# EasyEDA Pro project ActiveMoCapDeck_pre.eprj

# Schematic ActivaMoCapDeck
Board Name: ActiveMoCapDeck; Create Date: 2024-09-30; Page Name: sch_1; Project Name: ActiveMoCapDeck; Schematic Name: ActivaMoCapDeck; Update Date: 2024-10-01
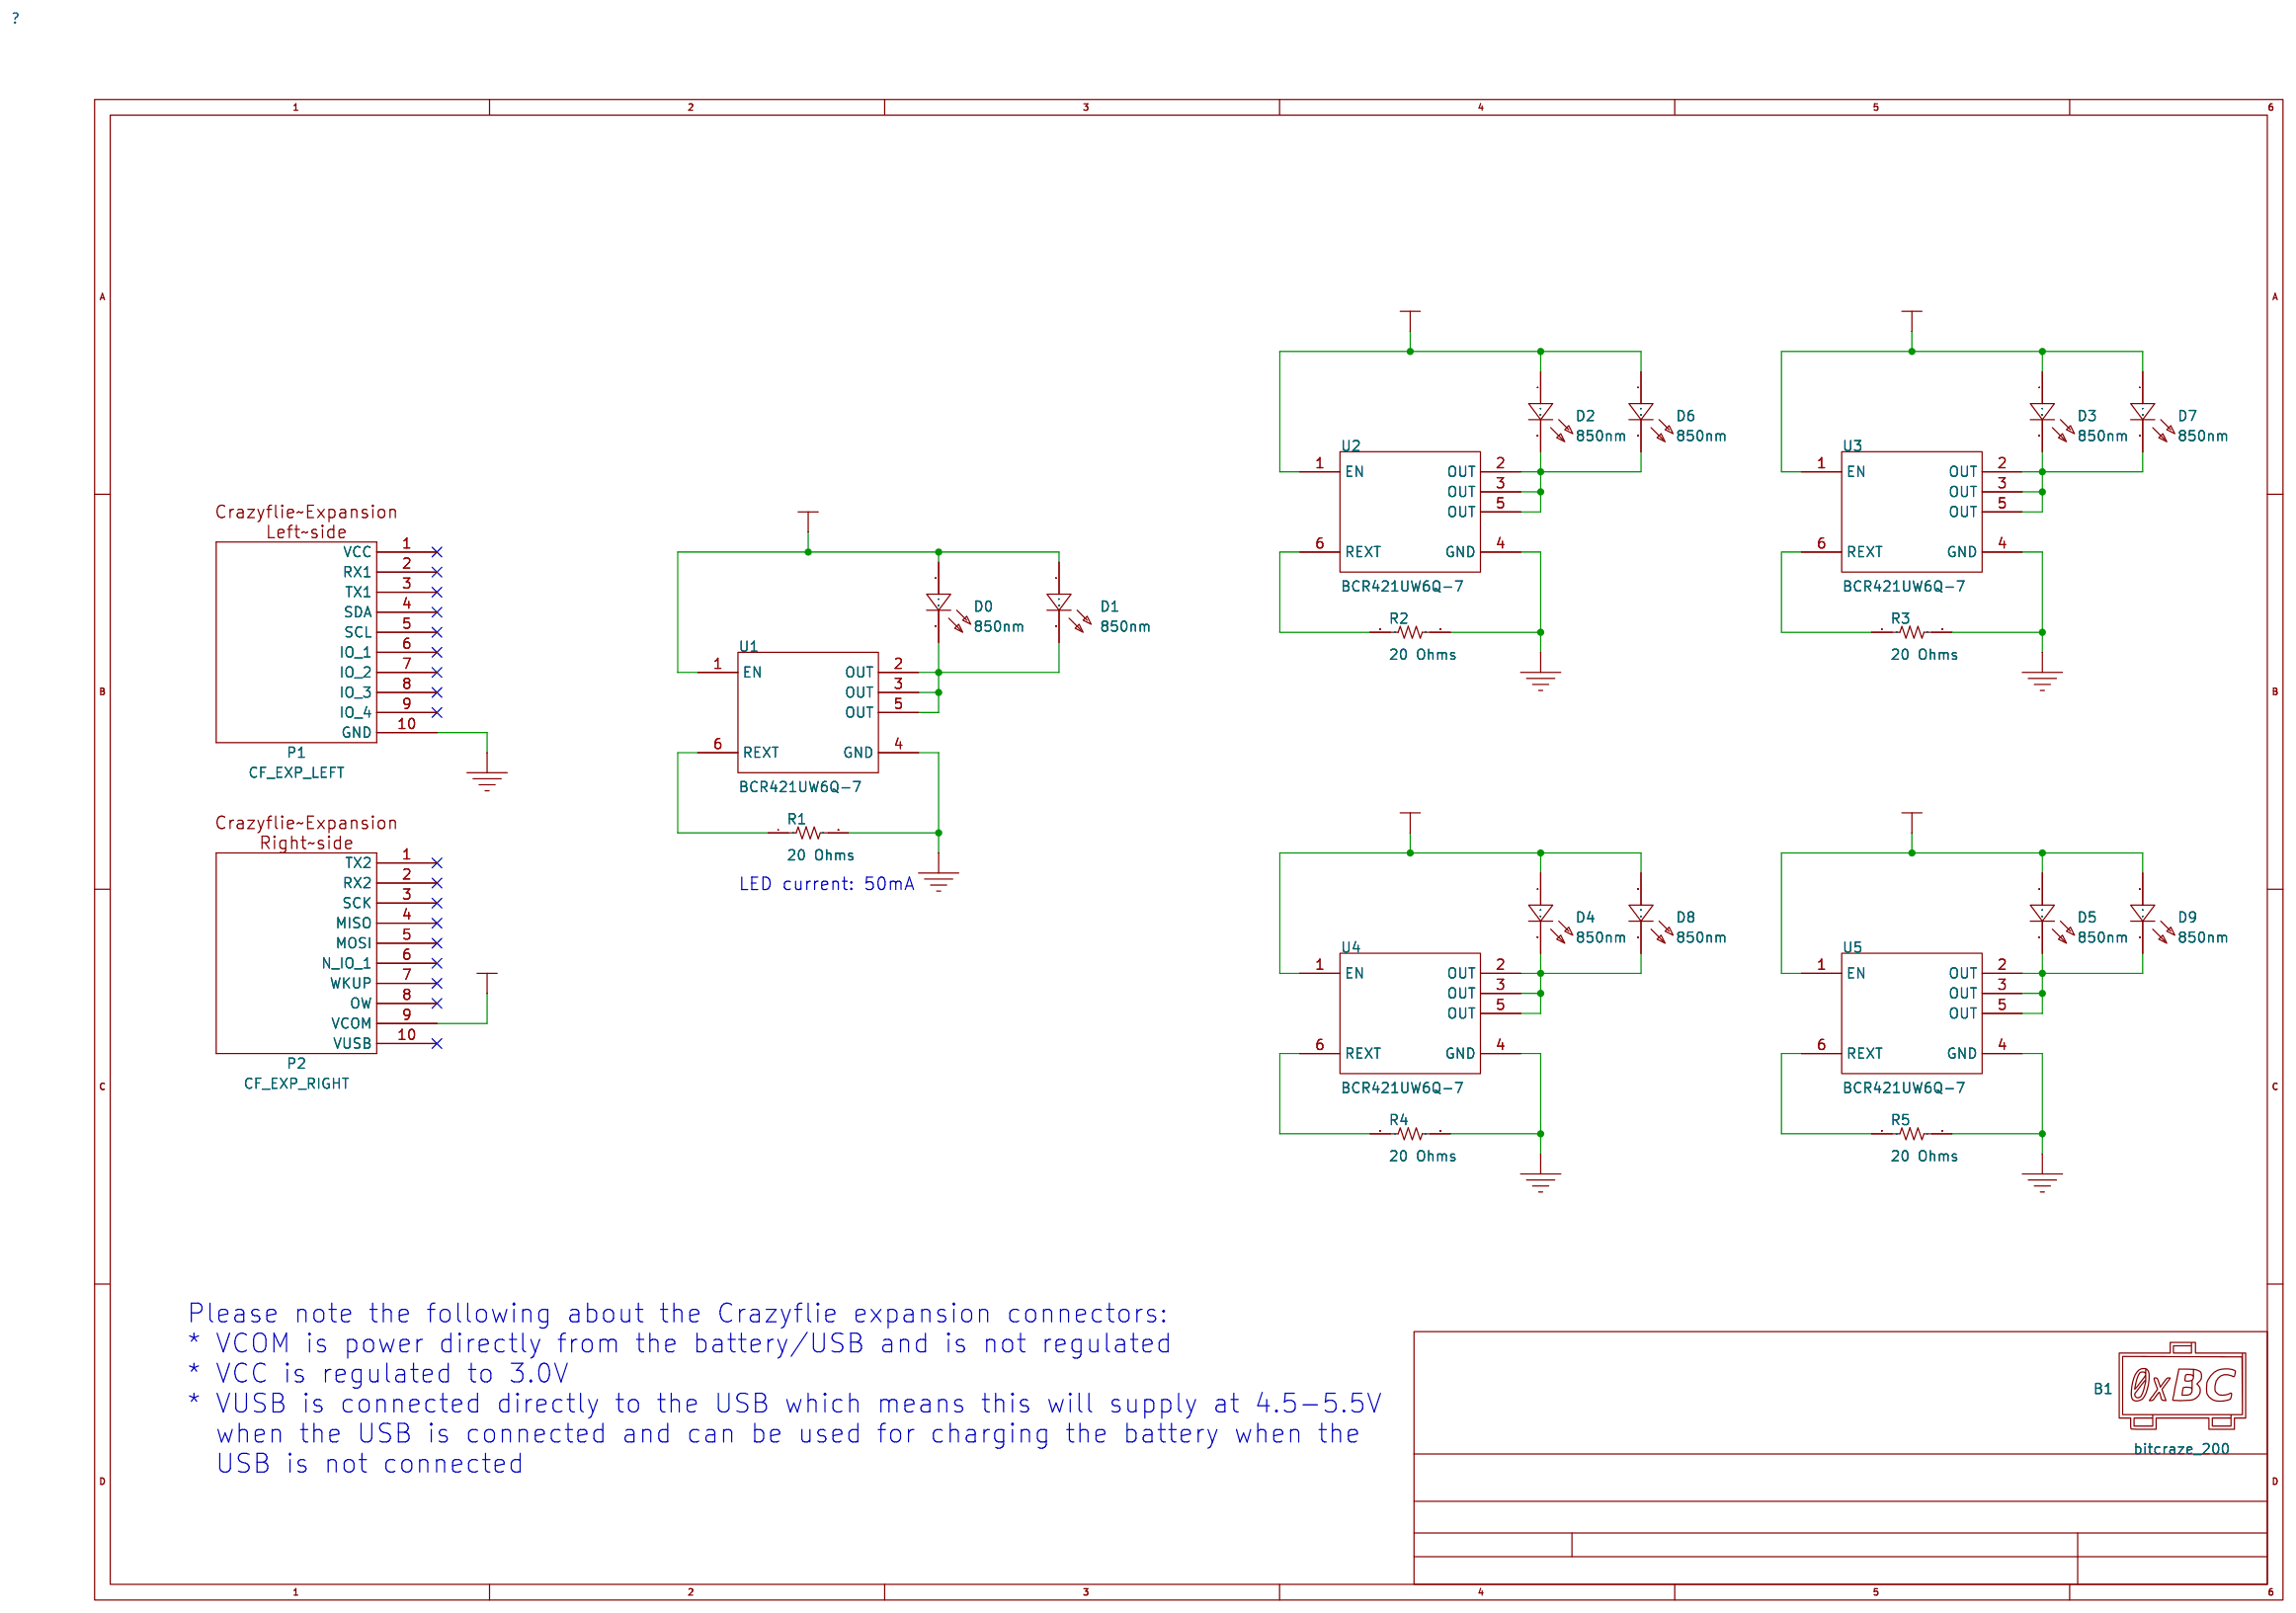
[diagram p0: schematic sheet]

## Parts
B1  bitcraze_200  [EXP_ORIENTATION]
D0  Red  [LED 0603_1608 RED]
D1  Red  [LED 0603_1608 RED]
D2  Red  [LED 0603_1608 RED]
D3  Red  [LED 0603_1608 RED]
D4  Red  [LED 0603_1608 RED]
D5  Red  [LED 0603_1608 RED]
D6  Red  [LED 0603_1608 RED]
D7  Red  [LED 0603_1608 RED]
D8  Red  [LED 0603_1608 RED]
D9  Red  [LED 0603_1608 RED]
P1  CF_EXP_LEFT  [BF090-10-X-B2]
P2  CF_EXP_RIGHT  [BF090-10-X-B2]
R1  20 Ohms  [RES 0603_1608]
R2  20 Ohms  [RES 0603_1608]
R3  20 Ohms  [RES 0603_1608]
R4  20 Ohms  [RES 0603_1608]
R5  20 Ohms  [RES 0603_1608]
U1  BCR421UW6Q-7  [FP-SOT26_SC74R-MFG]
U2  BCR421UW6Q-7  [FP-SOT26_SC74R-MFG]
U3  BCR421UW6Q-7  [FP-SOT26_SC74R-MFG]
U4  BCR421UW6Q-7  [FP-SOT26_SC74R-MFG]
U5  BCR421UW6Q-7  [FP-SOT26_SC74R-MFG]

## Library data of the parts
B1 = bitcraze_200
D0-D9 = 850nm: LED RED SMD; Part Number: CL-196HR-CD-T; ComponentLink1Description: Datasheet; ComponentLink1URL: http://ce.citizen.co.jp/up_img/product/zzOM8tpTLfGL/CL-196_e.pdf; ComponentLink2Description: DigiKey Link; ComponentLink2URL: https://www.digikey.com/en/products/detail/citizen/CL-196HR-CD-T/6005906; Configuration: Standard; Current - Test: 20mA; Device Package: 0603 (1608 Metric); Height (Max): 0.60mm; LastUpdated: 30/08/2022 14:34:25; Lens Color: 0.60mm; Lens Size: 1.60mm x 0.80mm; Lens Style: Rectangle with Flat Top; Lifecycle Status: Active; Manufacturer: Citizen; Millicandela Rating: 23mcd; Minimum Order: 1; Mounting Type: Surface Mount; Package / Case: 0603 (1608 Metric); Packaging: TapeAndReel; PartId: 499; Part Status: Active; Price: 0.06; Series: CL-196; Size / Dimension: 1.60mm L x 0.80mm W; Voltage - Forward (Vf) (Typ): 1.8V; Wavelength - Dominant: 640nm; Supplier 1: Arrow Electronics; Supplier Part Number 1: HIR19-21C/L11/TR8; Design Item ID: CL-196HR-CD-T; Library Name: Celestial Altium Library - altium_library; Datasheet: http://ce.citizen.co.jp/up_img/product/zzOM8tpTLfGL/CL-196_e.pdf
P1 = CF_EXP_LEFT: Library Name: *
P2 = CF_EXP_RIGHT: Library Name: *
R1-R5 = 20 Ohms: RES 20 OHM 5% 1/10W 0603; Part Number: RC0603JR-0720RL; ComponentLink1Description: Datasheet; ComponentLink1URL: https://www.yageo.com/upload/media/product/productsearch/datasheet/rchip/PYu-RC_Group_51_RoHS_L_10.pdf; ComponentLink2Description: DigiKey Link; ComponentLink2URL: https://www.digikey.com/en/products/detail/yageo/RC0603JR-0720RL/726739; Composition: Thick Film; Device Package: 0603 (1608 Metric); Features: Moisture Resistant; Height - Seated (Max): 0.022&quot; (0.55mm); LastUpdated: 01/09/2022 12:52:35; Lifecycle Status: Active; Manufacturer: Yageo; Minimum Order: 1; Number of Terminations: 2; Operating Temperature: -55°C ~ 155°C; Package / Case: 0603 (1608 Metric); Packaging: CutTape; PartId: 17211; Part Status: Active; Power (Watts): 0.1W, 1/10W; Price: 0.01; Series: RC_L; Size / Dimension: 0.063&quot; L x 0.031&quot; W (1.60mm x 0.80mm); Supplier 1: DigiKey; Supplier Part Number 1: 311-20GRCT-ND; Supplier Device Package: 0603; Temperature Coefficient: ±100ppm/°C; Tolerance: ±5%; Design Item ID: RC0603JR-0720RL; Library Name: Celestial Altium Library - altium_library; Datasheet: https://www.yageo.com/upload/media/product/productsearch/datasheet/rchip/PYu-RC_Group_51_RoHS_L_10.pdf
U1-U5 = BCR421UW6Q-7: TRANSISTOR LED DRIVER SOT26 T&amp;R; Manufacturer: Diodes Inc.; Digikey Description: TRANSISTOR LED DRIVER SOT26 T&amp;R; Octopart: https://octopart.com/bcr421uw6q-7-diodes+inc.-67219224; Lead Free: Yes; Output Current: 10mA; Footprint Url: https://www.diodes.com/assets/Package-Files/SOT26-SC74R.pdf; ComponentLink2URL: https://www.diodes.com/assets/Datasheets/BCR420UW6Q_BCR421UW6Q.pdf; ComponentLink2Description: Datasheet; Automotive: Yes; Temperature Range High: +150°C; Device Class L3: LED Drivers; RoHS: TRUE; Number Of Outputs: 1; Temperature Range Low: -55°C; Max Junction Temp: +150°C; Automotive Grade: Grade 0; Device Class L2: Power Management ICs; Category: IC; Standoff Height: 0.013mm; Device Class L1: Integrated Circuits (ICs); Mouser Description: LED Lighting Drivers 40V Linear LED 1W 10mA 10% 350mA; Dimming: PWM; Height: 1.4mm; Temperature: -55°C to +150°C; Max Power Dissipation: 912mW; Output Voltage: 40V; Origin Footprint 2: FP-SOT26_SC74R-IPC_C; Origin Footprint 3: FP-SOT26_SC74R-IPC_B; Origin Footprint 4: FP-SOT26_SC74R-IPC_A; Design Item ID: CMP-12753-000005-1; Library Name: Altium Content Vault; Datasheet: https://www.diodes.com/assets/Datasheets/BCR420UW6Q_BCR421UW6Q.pdf

## Nets
GND: P1.10(GND) R1.2 R2.2 R3.2 R4.2 R5.2 U1.4(GND) U2.4(GND) U3.4(GND) U4.4(GND) U5.4(GND)
VCOM: D0.1 D1.1 D2.1 D3.1 D4.1 D5.1 D6.1 D7.1 D8.1 D9.1 P2.9(VCOM) U1.1(EN) U2.1(EN) U3.1(EN) U4.1(EN) U5.1(EN)
$1N1437: R1.1 U1.6(REXT)
$1N1453: R4.1 U4.6(REXT)
$1N1460: D0.2 D1.2 U1.2(OUT) U1.3(OUT) U1.5(OUT)
$1N1467: R2.1 U2.6(REXT)
$1N1488: R5.1 U5.6(REXT)
$1N1492: D5.2 D9.2 U5.2(OUT) U5.3(OUT) U5.5(OUT)
$1N1510: D4.2 D8.2 U4.2(OUT) U4.3(OUT) U4.5(OUT)
$1N1524: R3.1 U3.6(REXT)
$1N1533: D3.2 D7.2 U3.2(OUT) U3.3(OUT) U3.5(OUT)
$1N1560: D2.2 D6.2 U2.2(OUT) U2.3(OUT) U2.5(OUT)

Not connected (* = marked no-connect by the designer): P1 1(VCC)* 2(RX1)* 3(TX1)* 4(SDA)* 5(SCL)* 6(IO_1)* 7(IO_2)* 8(IO_3)* 9(IO_4)*; P2 1(TX2)* 2(RX2)* 3(SCK)* 4(MISO)* 5(MOSI)* 6(N_IO_1)* 7(WKUP)* 8(OW)* 10(VUSB)*

## Notes on the sheet
- LED current: 50mA
- Please note the following about the Crazyflie expansion connectors:
  * VCOM is power directly from the battery/USB and is not regulated
  * VCC is regulated to 3.0V
  * VUSB is connected directly to the USB which means this will supply at 4.5-5.5V
    when the USB is connected and can be used for charging the battery when the
    USB is not connected

# Board pcb
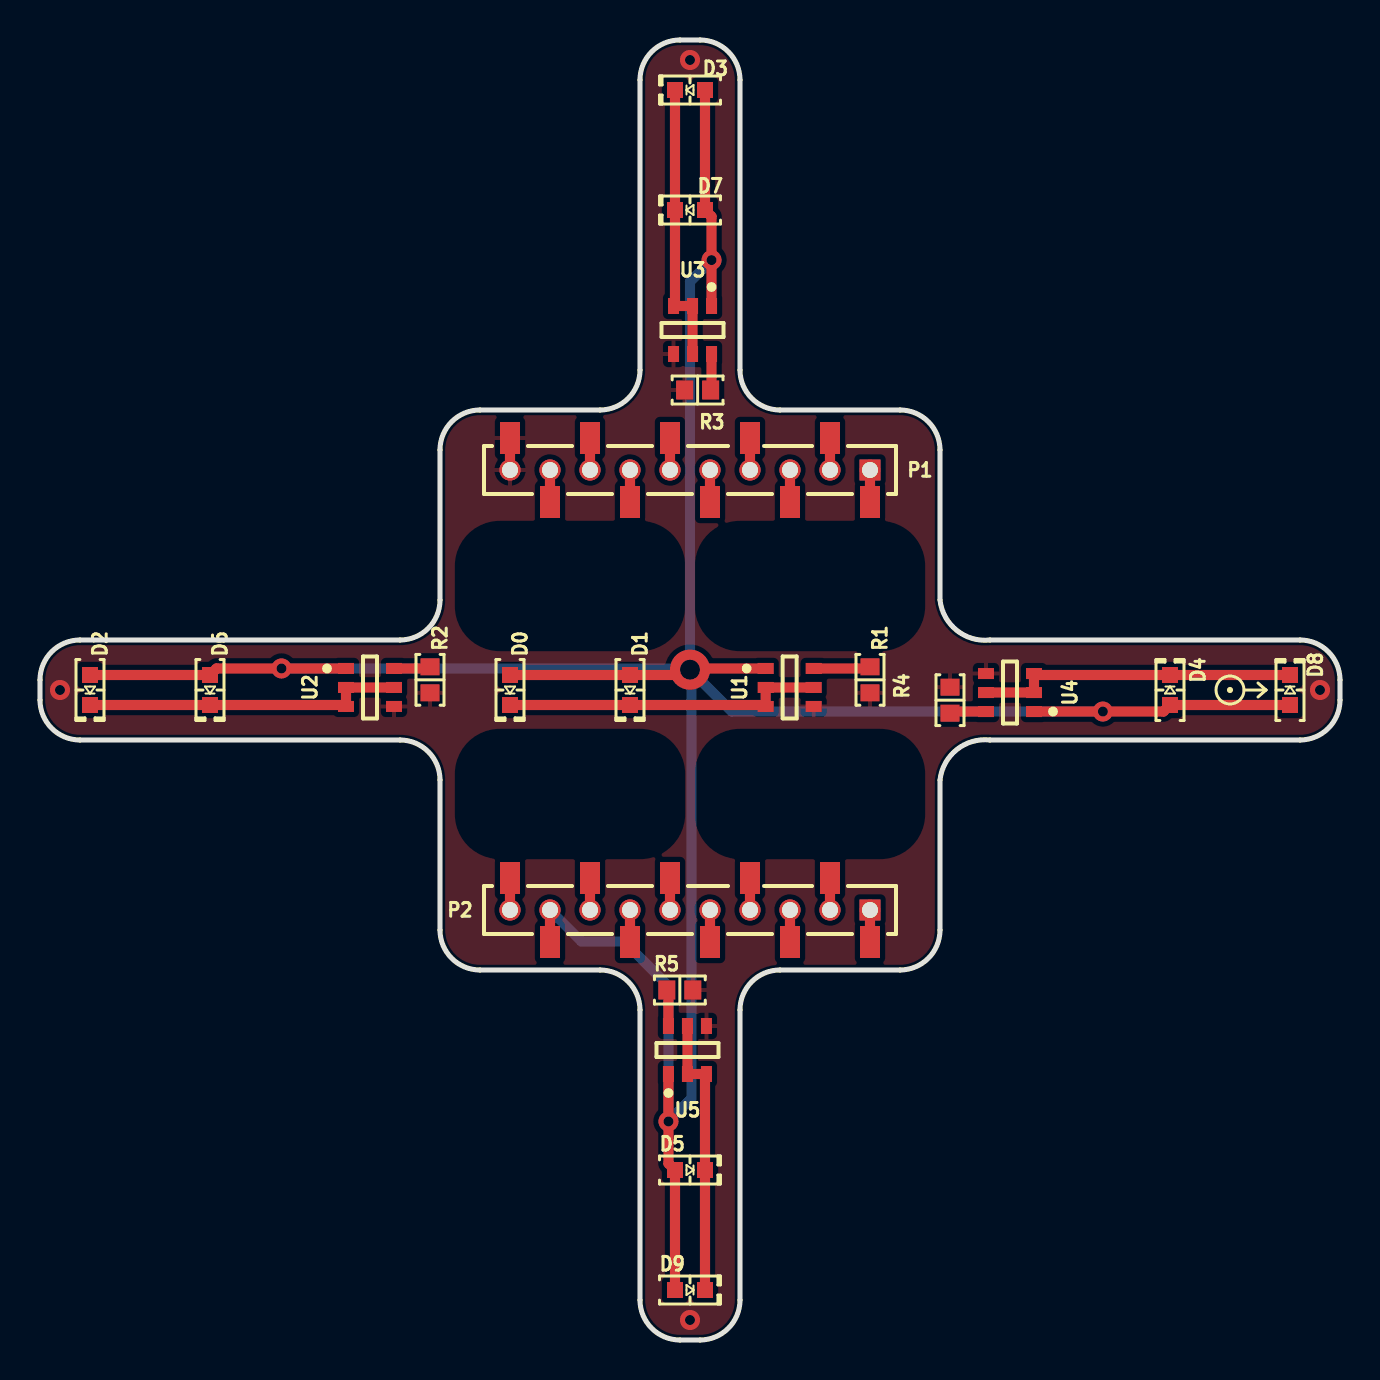
[diagram p1: board, top side]
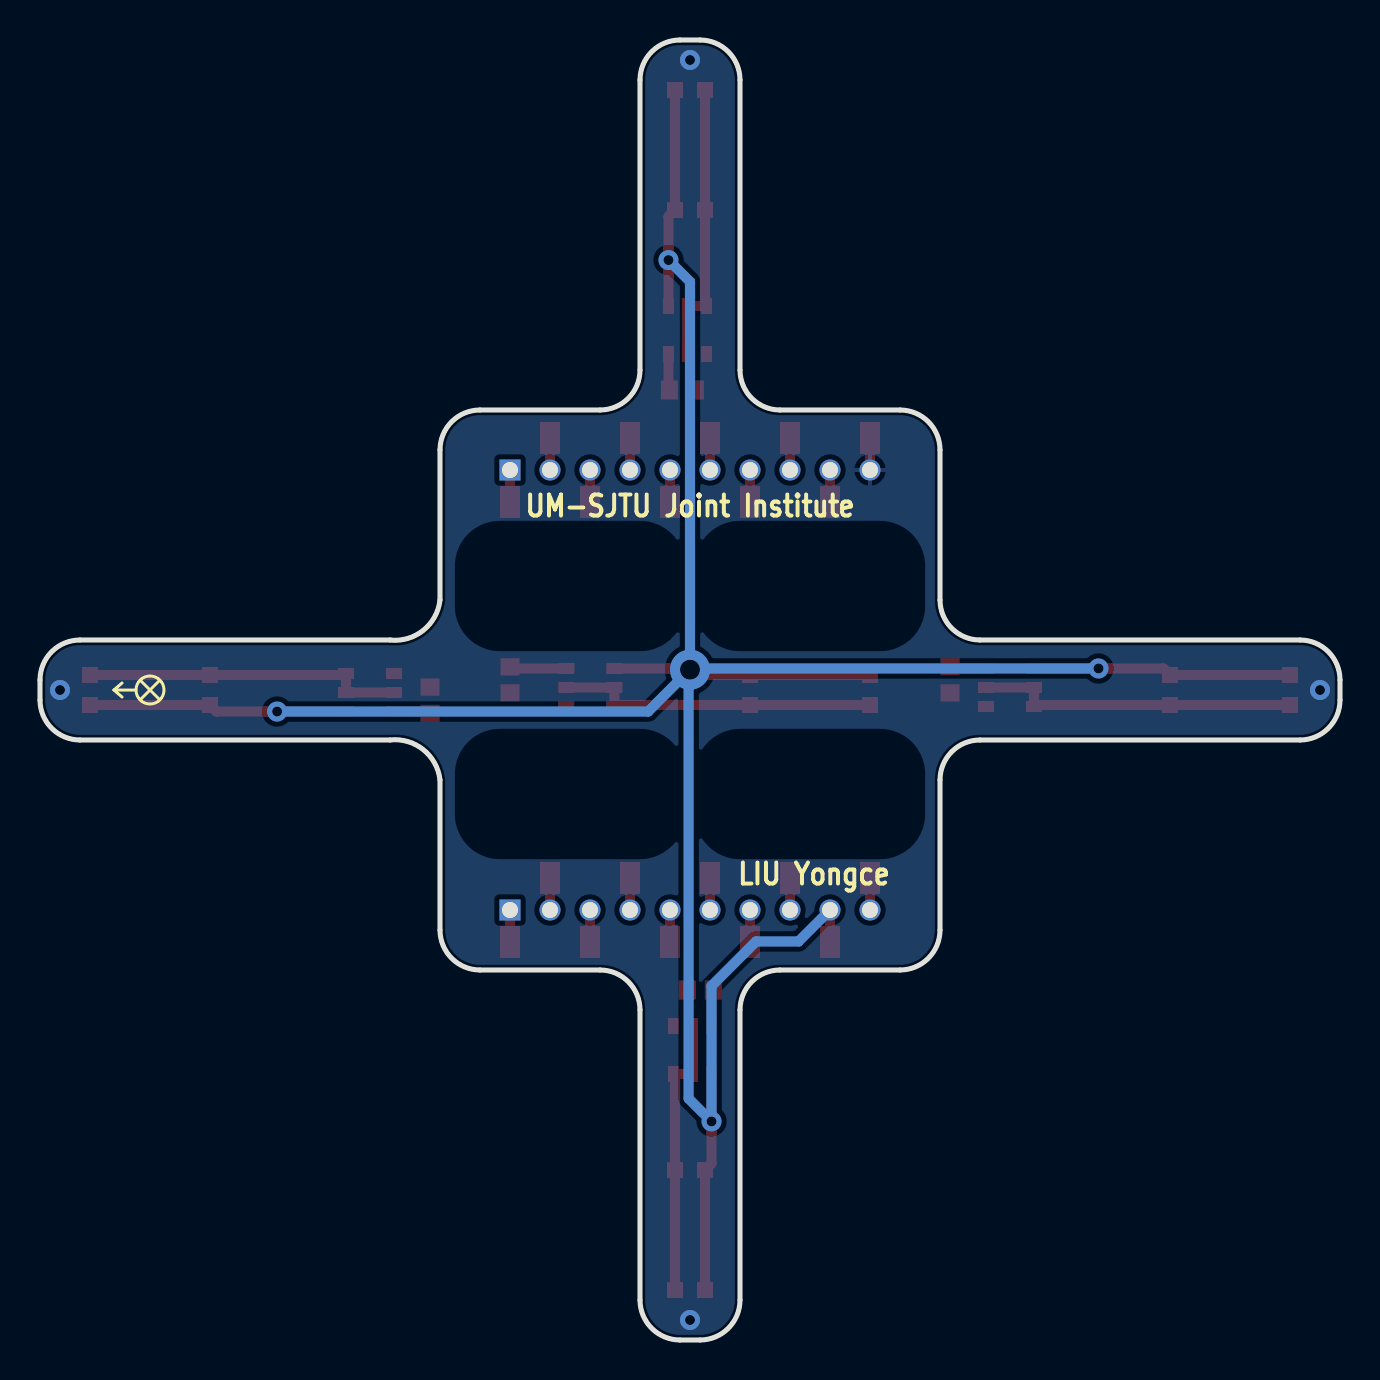
[diagram p2: board, bottom side, seen from below]

Outline 65 x 65 mm; copper layers: Top Layer, Bottom Layer. Coordinates in mm from the lower left corner of the outline.
Outline path: 0,33 arc(0.59,34.41) 2,35 18,35 arc(19.41,35.59) 20,37 20,44.5 arc(20.59,45.91) 22,46.5 28,46.5 arc(29.41,47.09) 30,48.5 30,63 arc(30.59,64.41) 32,65 33,65 arc(34.41,64.41) 35,63 35,48.5 arc(35.59,47.09) 37,46.5 43,46.5 arc(44.41,45.91) 45,44.5 45,37 arc(45.84,35.48) 47.5,35 63,35 arc(64.41,34.41) 65,33 65,32 arc(64.41,30.59) 63,30 47.5,30 arc(45.84,29.52) 45,28 45,20.5 arc(44.41,19.09) 43,18.5 37,18.5 arc(35.59,17.91) 35,16.5 35,2 arc(34.41,0.59) 33,0 32,0 arc(30.59,0.59) 30,2 30,16.5 arc(29.41,17.91) 28,18.5 22,18.5 arc(20.59,19.09) 20,20.5 20,28 arc(19.41,29.41) 18,30 2,30 arc(0.59,30.59) 0,32 0,33
Stack: Top Layer 0.035mm / Dielectric1 1.51mm FR4 er 4.5 / Bottom Layer 0.035mm

## Design rules (mm)
spacing Default (default): track to track 0.152, other pairs 0 to 0.152
track width Default (default): min 0.203, default 0.203, max 2.54
differential pair Default (default): width min 0, default 0, max 2.54; gap min 0, default 0
via Default (default): diameter min 0.635, default 0.635, max 10.003; hole min 0.381, default 0.381, max 5.999

## Placement (name value [footprint] x y rotation side)
B1  bitcraze_200  [EXP_ORIENTATION]  59.5 32.5 0 top
D0  Red  [LED 0603_1608 RED]  23.5 32.5 270 top
D1  Red  [LED 0603_1608 RED]  29.5 32.5 270 top
D2  Red  [LED 0603_1608 RED]  2.5 32.5 270 top
D3  Red  [LED 0603_1608 RED]  32.5 62.5 180 top
D4  Red  [LED 0603_1608 RED]  56.5 32.5 90 top
D5  Red  [LED 0603_1608 RED]  32.5 8.5 0 top
D6  Red  [LED 0603_1608 RED]  8.5 32.5 270 top
D7  Red  [LED 0603_1608 RED]  32.5 56.5 180 top
D8  Red  [LED 0603_1608 RED]  62.5 32.5 90 top
D9  Red  [LED 0603_1608 RED]  32.5 2.5 0 top
P1  CF_EXP_LEFT  [BF090-10-X-B2]  32.5 43.5 180 top
P2  CF_EXP_RIGHT  [BF090-10-X-B2]  32.5 21.5 180 top
R1  20 Ohms  [RES 0603_1608]  41.5 33.01 270 top
R2  20 Ohms  [RES 0603_1608]  19.5 33.01 270 top
R3  20 Ohms  [RES 0603_1608]  32.88 47.5 180 top
R4  20 Ohms  [RES 0603_1608]  45.5 31.99 90 top
R5  20 Ohms  [RES 0603_1608]  31.99 17.5 0 top
U1  BCR421UW6Q-7  [FP-SOT26_SC74R-MFG]  37.48 32.63 0 top
U2  BCR421UW6Q-7  [FP-SOT26_SC74R-MFG]  16.5 32.63 0 top
U3  BCR421UW6Q-7  [FP-SOT26_SC74R-MFG]  32.63 50.5 270 top
U4  BCR421UW6Q-7  [FP-SOT26_SC74R-MFG]  48.5 32.37 180 top
U5  BCR421UW6Q-7  [FP-SOT26_SC74R-MFG]  32.37 14.5 90 top

## Footprints (pads in the part's own frame, mm; a bottom-side part is the same pattern mirrored in y, then rotated)
BF090-10-X-B2
  rect 1x1.6 smd: 1(-9,1.6) 2(-7,-1.6) 3(-5,1.6) 4(-3,-1.6) 5(-1,1.6) 6(1,-1.6) 7(3,1.6) 8(5,-1.6) 9(7,1.6) 10(9,-1.6)
  round 1.05 smd: 1(-9,0) 2(-7,0) 3(-5,0) 4(-3,0) 5(-1,0) 6(1,0) 7(3,0) 8(5,0) 9(7,0) 10(9,0)
  rect 1.05x1.05 hole 0.8: 1(-9,0)
  round 1.05 hole 0.8: 2(-7,0) 3(-5,0) 4(-3,0) 5(-1,0) 6(1,0) 7(3,0) 8(5,0) 9(7,0) 10(9,0)
FP-SOT26_SC74R-MFG
  rect 0.8x0.55 smd: 1(-1.2,0.95) 2(-1.2,0) 3(-1.2,-0.95) 4(1.2,-0.95) 5(1.2,0) 6(1.2,0.95)
LED 0603_1608 RED
  rect 0.8x0.8 smd: 1(-0.75,0) 2(0.75,0)
RES 0603_1608
  rect 0.85x0.95 smd: 1(-0.65,0) 2(0.65,0)

## Nets
As in the schematic.

Pads without a net: P1 1 2 3 4 5 6 7 8 9; P2 1 2 3 4 5 6 7 8 10

## Via types
v1: diameter 1, hole 0.5, Top Layer to Bottom Layer, 8 vias
v2: diameter 2, hole 1, Top Layer to Bottom Layer, 1 via

## Routing (per net, layer and track width the routed paths; a pad name or vN(x,y) marks a point on that pad's centre or on a via; arc(x,y) is an arc through that point)
GND: length 1.6
  Top Layer w0.508: P1.10 P1.10
  vias: v1(1,32.5) v1(32.5,64) v1(32.5,1) v1(64,32.5)
(no net): length 28.8
  Top Layer w0.508: P2.4 P2.4 ; P2.1 P2.1 ; P2.10 P2.10 ; P2.6 P2.6 ; P1.2 P1.2 ; P2.5 P2.5 ; P2.8 P2.8 ; P1.8 P1.8 ; P1.3 P1.3 ; P1.5 P1.5 ; P2.7 P2.7 ; P1.9 P1.9 ; P1.4 P1.4 ; P2.2 P2.2 ; P1.6 P1.6 ; P1.7 P1.7 ; P2.3 P2.3 ; P1.1 P1.1
VCOM: length 162.3
  Top Layer w0.508: D8.1 D4.1 56.17,31.42 v1(53.14,31.42) U4.1 ; D2.1 D6.1 8.83,33.58 v1(12.08,33.58) U2.1 ; U5.1 v1(31.42,10.93) 31.42,8.83 D5.1 D9.1 ; D3.1 D7.1 33.58,56.17 v1(33.58,54) U3.1 ; U1.1 32.56,33.58 v2(32.5,33.52) 32.23,33.25 D1.1 D0.1 ; P2.9 P2.9
  Bottom Layer w0.508: v1(12.08,33.58) 32.44,33.58 v2(32.5,33.52) 32.5,52.92 v1(33.58,54) ; P2.9 27.07,19.93 29.2,19.93 31.42,17.7 v1(31.42,10.93) 32.57,12.07 32.57,33.45 34.59,31.42 v1(53.14,31.42)
$1N1437: length 2.8
  Top Layer w0.508: R1.1 41.42,33.58 U1.6
$1N1453: length 1.8
  Top Layer w0.508: R4.1 45.58,31.42 U4.6
$1N1460: length 16.2
  Top Layer w0.508: D0.2 D1.2 36.21,31.75 U1.3 U1.2 U1.5
$1N1467: length 1.8
  Top Layer w0.508: R2.1 19.42,33.58 U2.6
$1N1488: length 1.8
  Top Layer w0.508: U5.6 31.42,17.42 R5.1
$1N1492: length 14.2
  Top Layer w0.508: U5.5 U5.2 33.32,13.3 33.25,13.23 D5.2 D9.2
$1N1510: length 16.2
  Top Layer w0.508: D8.2 D4.2 49.77,33.25 U4.3 U4.2 U4.5
$1N1524: length 1.8
  Top Layer w0.508: U3.6 33.58,47.55 R3.1
$1N1533: length 14.2
  Top Layer w0.508: D3.2 D7.2 31.75,51.77 31.68,51.7 U3.2 U3.5
$1N1560: length 16.2
  Top Layer w0.508: U2.5 U2.2 U2.3 15.23,31.75 D6.2 D2.2

## Copper pours and planes (outline as drawn; the poured copper is in the pictures)
GND on Top Layer: -2.04,66.28 65.96,66.28 65.96,-1.72 -2.04,-1.72
GND on Bottom Layer: -2.04,66.34 65.96,66.34 65.96,-1.66 -2.04,-1.66

## Text on the board
Bottom Silkscreen Layer: LIU Yongce | UM-SJTU Joint Institute
Document Layer: M1 | M4 | M3 | M2 | ANT | Crazyflie 2.0 | uUSB / TOP | BAT | SWD / BOTTOM | BTN | Bitcraze
